# EAGLE design Pi3ToRFIDSchematic (EAGLE 8.7.0)

## Sheet 1 of 2: BoardOne
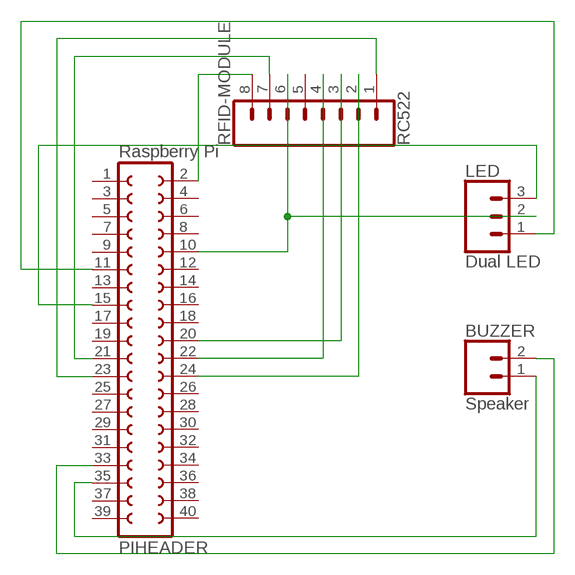
[diagram p0: schematic, sheet 1]

### Parts
BUZZER  Speaker  CONN_02POLAR  [MOLEX-1X2]
LED  Dual LED  CONN_03POLAR  [MOLEX-1X3]
PIHEADER  Raspberry Pi  FE20-2W  [FE20-2W]
RFID-MODULE  RC522  CONN_08LONGPADS  [1X08_LONGPADS]

### Nets
N$1: PIHEADER.2 RFID-MODULE.8
N$2: PIHEADER.21 RFID-MODULE.7
N$3: PIHEADER.22 RFID-MODULE.4
N$4: PIHEADER.20 RFID-MODULE.3
N$5: PIHEADER.24 RFID-MODULE.2
N$6: PIHEADER.23 RFID-MODULE.1
N$7: BUZZER.2 PIHEADER.33
N$8: LED.1 PIHEADER.11
N$10: BUZZER.1 PIHEADER.35
N$11: LED.3 PIHEADER.15
N$12: LED.2 PIHEADER.10 RFID-MODULE.6
Unconnected: PIHEADER.1 PIHEADER.3 PIHEADER.4 PIHEADER.5 PIHEADER.6 PIHEADER.7 PIHEADER.8 PIHEADER.9 PIHEADER.12 PIHEADER.13 PIHEADER.14 PIHEADER.16 PIHEADER.17 PIHEADER.18 PIHEADER.19 PIHEADER.25 PIHEADER.26 PIHEADER.27 PIHEADER.28 PIHEADER.29 PIHEADER.30 PIHEADER.31 PIHEADER.32 PIHEADER.34 PIHEADER.36 PIHEADER.37 PIHEADER.38 PIHEADER.39 PIHEADER.40 RFID-MODULE.5

## Sheet 2 of 2: BoardTwo
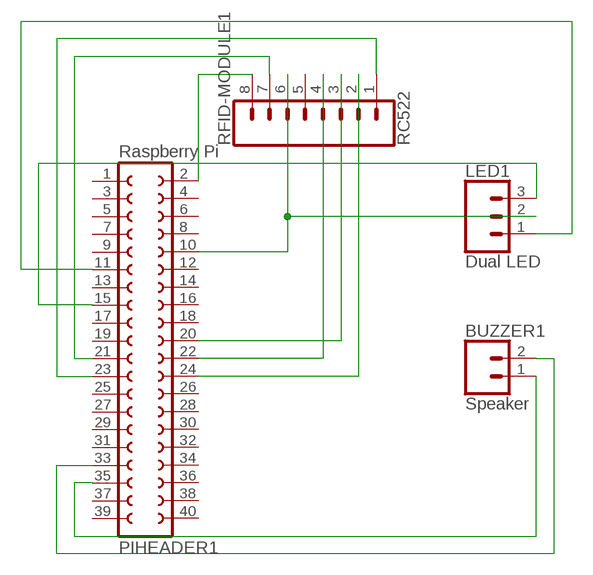
[diagram p1: schematic, sheet 2]

### Parts
BUZZER1  Speaker  CONN_02POLAR  [MOLEX-1X2]
LED1  Dual LED  CONN_03POLAR  [MOLEX-1X3]
PIHEADER1  Raspberry Pi  FE20-2W  [FE20-2W]
RFID-MODULE1  RC522  CONN_08LONGPADS  [1X08_LONGPADS]

### Nets
N$9: PIHEADER1.2 RFID-MODULE1.8
N$13: PIHEADER1.21 RFID-MODULE1.7
N$14: PIHEADER1.22 RFID-MODULE1.4
N$15: PIHEADER1.20 RFID-MODULE1.3
N$16: PIHEADER1.24 RFID-MODULE1.2
N$17: PIHEADER1.23 RFID-MODULE1.1
N$18: BUZZER1.2 PIHEADER1.33
N$19: BUZZER1.1 PIHEADER1.35
N$20: LED1.3 PIHEADER1.15
N$21: LED1.1 PIHEADER1.11
N$22: LED1.2 PIHEADER1.10 RFID-MODULE1.6
Unconnected: PIHEADER1.1 PIHEADER1.3 PIHEADER1.4 PIHEADER1.5 PIHEADER1.6 PIHEADER1.7 PIHEADER1.8 PIHEADER1.9 PIHEADER1.12 PIHEADER1.13 PIHEADER1.14 PIHEADER1.16 PIHEADER1.17 PIHEADER1.18 PIHEADER1.19 PIHEADER1.25 PIHEADER1.26 PIHEADER1.27 PIHEADER1.28 PIHEADER1.29 PIHEADER1.30 PIHEADER1.31 PIHEADER1.32 PIHEADER1.34 PIHEADER1.36 PIHEADER1.37 PIHEADER1.38 PIHEADER1.39 PIHEADER1.40 RFID-MODULE1.5

## Library data of the parts
BUZZER BUZZER1 = SparkFun-Connectors:CONN_02: Multi connection point. Often used as Generic Header-pin footprint for 0.1 inch spaced/style header connections On any of the 0.1 inch spaced packages, you can populate with these: Break Away Headers - Straight <https://www.sparkfun.com/products/116> (PRT-00116) Break Away Male Headers - Right Angle <https://www.sparkfun.com/products/553> (PRT-00553) Female Headers <https://www.sparkfun.com/products/115> (PRT-00115) Break Away Headers - Machine Pin <https://www.sparkfun.com/products/117> (PRT-00117) Break Away Female Headers - Swiss Machine Pin <https://www.sparkfun.com/products/743> (PRT-00743) For SCREWTERMINALS and SPRING TERMINALS visit here: Screw Terimnals on SparkFun.com <https://www.sparkfun.com/search/results?term=Screw+Terminals> (5mm/3.5mm/2.54mm spacing) This device is also useful as a general connection point to wire up your design to another part of your project. Our various solder wires solder well into these plated through hole pads. Hook-Up Wire - Assortment (Stranded, 22 AWG) <https://www.sparkfun.com/products/11375> (PRT-11375) Hook-Up Wire - Assortment (Solid Core, 22 AWG) <https://www.sparkfun.com/products/11367> (PRT-11367) View the entire wire category on our website here <https://www.sparkfun.com/categories/141> Special notes: Molex polarized connector foot print use with: PRT-08233 with associated crimp pins and housings. 2.54_SCREWTERM for use with PRT-10571. 3.5mm Screw Terminal footprints for PRT-08084 5mm Screw Terminal footprints for use with PRT-08432; SF_ID: PRT-09918
LED LED1 = SparkFun-Connectors:CONN_03: Multi connection point. Often used as Generic Header-pin footprint for 0.1 inch spaced/style header connections On any of the 0.1 inch spaced packages, you can populate with these: Break Away Headers - Straight <https://www.sparkfun.com/products/116> (PRT-00116) Break Away Male Headers - Right Angle <https://www.sparkfun.com/products/553> (PRT-00553) Female Headers <https://www.sparkfun.com/products/115> (PRT-00115) Break Away Headers - Machine Pin <https://www.sparkfun.com/products/117> (PRT-00117) Break Away Female Headers - Swiss Machine Pin <https://www.sparkfun.com/products/743> (PRT-00743) Stackable Header - 3 Pin (Female, 0.1") <https://www.sparkfun.com/products/13875> (PRT-13875) For SCREWTERMINALS and SPRING TERMINALS visit here: Screw Terimnals on SparkFun.com <https://www.sparkfun.com/search/results?term=Screw+Terminals> (5mm/3.5mm/2.54mm spacing) This device is also useful as a general connection point to wire up your design to another part of your project. Our various solder wires solder well into these plated through hole pads. Hook-Up Wire - Assortment (Stranded, 22 AWG) <https://www.sparkfun.com/products/11375> (PRT-11375) Hook-Up Wire - Assortment (Solid Core, 22 AWG) <https://www.sparkfun.com/products/11367> (PRT-11367) View the entire wire category on our website here <https://www.sparkfun.com/categories/141> Special notes: Molex polarized connector foot print use with SKU : PRT-08232 with associated crimp pins and housings.; PROD_ID: CONN-08625; SF_ID: PRT-08096
PIHEADER PIHEADER1 = con-lsta:FE20-2W: FEMALE HEADER; OC_FARNELL: unknown; OC_NEWARK: unknown
RFID-MODULE RFID-MODULE1 = SparkFun-Connectors:CONN_08: Multi connection point. Often used as Generic Header-pin footprint for 0.1 inch spaced/style header connections On any of the 0.1 inch spaced packages, you can populate with these: Break Away Headers - Straight <https://www.sparkfun.com/products/116> (PRT-00116) Break Away Male Headers - Right Angle <https://www.sparkfun.com/products/553> (PRT-00553) Female Headers <https://www.sparkfun.com/products/115> (PRT-00115) Break Away Headers - Machine Pin <https://www.sparkfun.com/products/117> (PRT-00117) Break Away Female Headers - Swiss Machine Pin <https://www.sparkfun.com/products/743> (PRT-00743) Arduino Stackable Header - 8 Pin <https://www.sparkfun.com/products/9279> (PRT-09279) For SCREWTERMINALS and SPRING TERMINALS visit here: Screw Terimnals on SparkFun.com <https://www.sparkfun.com/search/results?term=Screw+Terminals> (5mm/3.5mm/2.54mm spacing) This device is also useful as a general connection point to wire up your design to another part of your project. Our various solder wires solder well into these plated through hole pads. Hook-Up Wire - Assortment (Stranded, 22 AWG) <https://www.sparkfun.com/products/11375> (PRT-11375) Hook-Up Wire - Assortment (Solid Core, 22 AWG) <https://www.sparkfun.com/products/11367> (PRT-11367) View the entire wire category on our website here <https://www.sparkfun.com/categories/141> Special notes: Molex polarized connector foot print use with SKU : PRT-08231 with associated crimp pins and housings. 1MM SMD Version SKU: PRT-10208 NOTES ON THE VARIANTS LOCK and LOCK_LONGPADS... This footprint was designed to help hold the alignment of a through-hole component (i.e. 6-pin header) while soldering it into place. You may notice that each hole has been shifted either up or down by 0.005 of an inch from it's more standard position (which is a perfectly straight line). This slight alteration caused the pins (the squares in the middle) to touch the edges of the holes. Because they are alternating, it causes a "brace" to hold the component in place. 0.005 has proven to be the perfect amount of "off-center" position when using our standard breakaway headers. Although looks a little odd when you look at the bare footprint, once you have a header in there, the alteration is very hard to notice. Also,if you push a header all the way into place, it is covered up entirely on the bottom side.

## Net classes
0 default: width 1 mm, drill 0.8 mm, clearance 0.4 mm

## Board
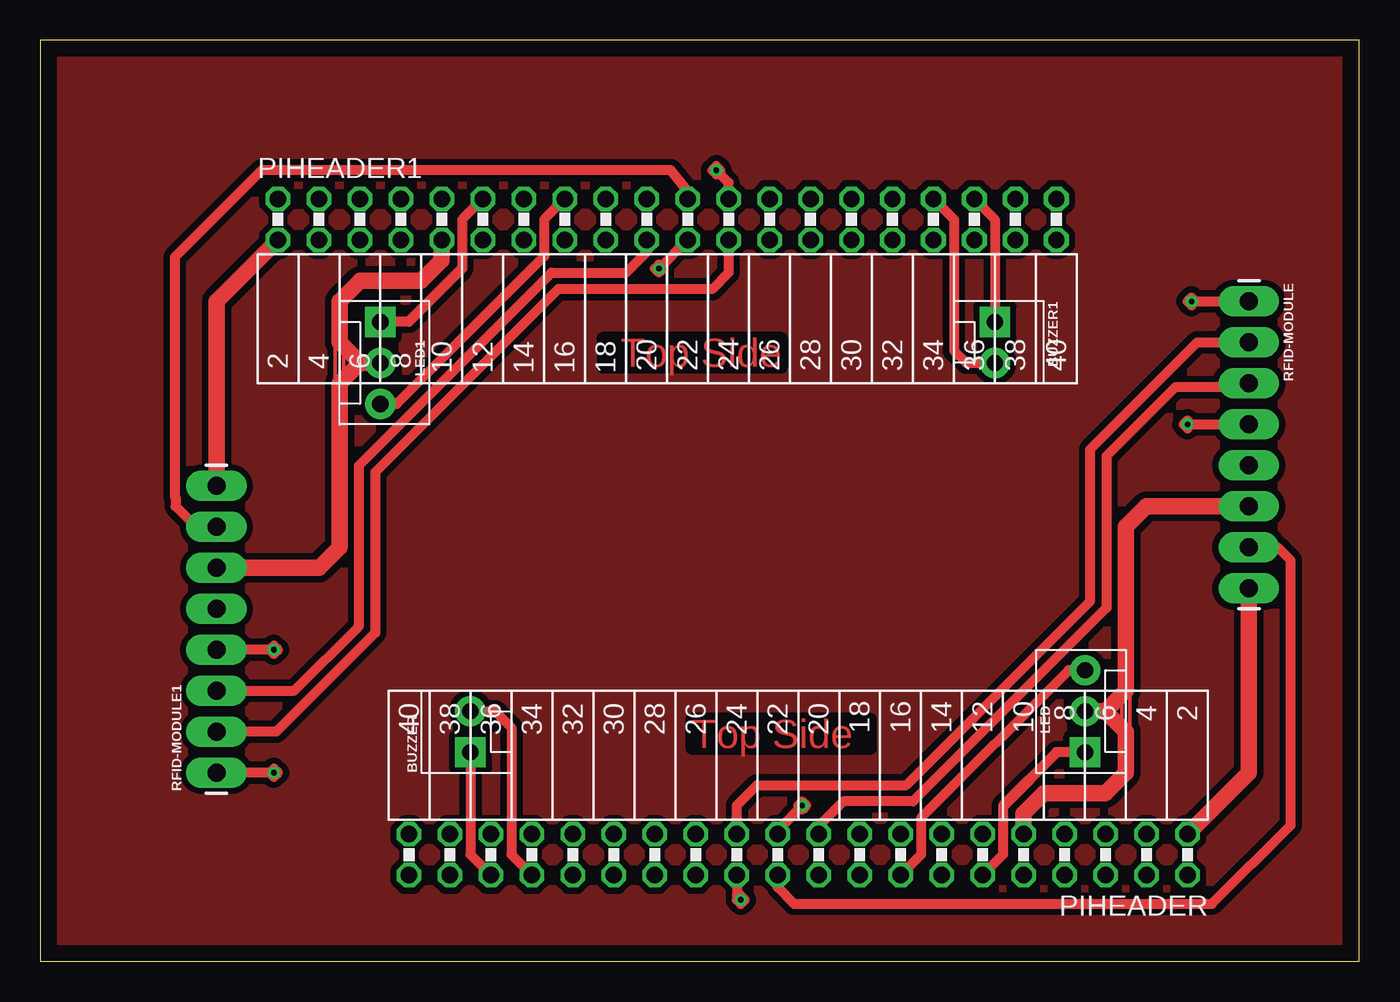
[diagram p2: board, top side]
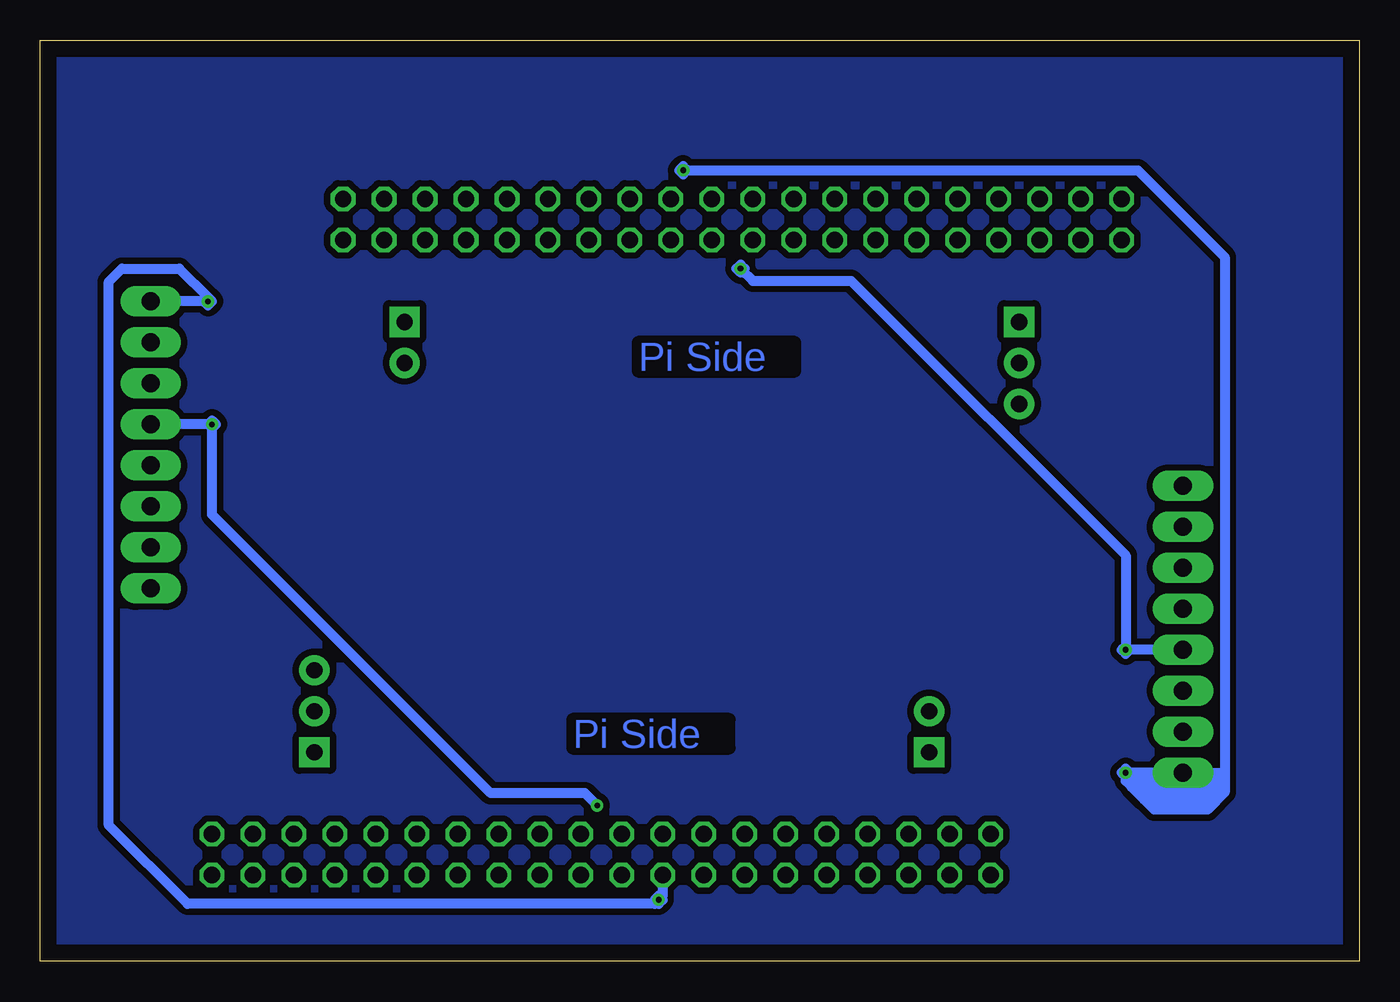
[diagram p3: board, bottom side, seen from below]

Size 81.77 x 57.07 mm. Coordinates in mm from the lower left corner, seen from the top.
Outline: 0,0 81.77,0 81.77,57.07 0,57.07 0,0
Copper layers (1*16): Top 0.035mm / dielectric 1.5mm / Bottom 0.035mm
Design rules "default *": minimum track width 6mil, minimum drill 0.35mm, track to track 6mil, track to pad 2mil, pad to pad 6mil, via to via 6mil, smd to smd 6mil, copper to edge 40mil, drill to drill 6mil, minimum pad ring 10mil, minimum via ring 8mil, stop-mask expansion 4mil, vias tented up to drill 0mil, thermal gap 10mil

### Footprints (pad centres in the part's own frame; a part is rotated, then mirrored left to right if it is on the bottom)
MOLEX-1X2 = drill 1.016 pad 1.88 square: 1 0,0 | drill 1.016 pad 1.88: 2 2.54,0
MOLEX-1X3 = drill 1.016 pad 1.88 square: 1 0,0 | drill 1.016 pad 1.88: 2 2.54,0; 3 5.08,0
FE20-2W = drill 1.016 octagon: 1 -24.13,1.27; 2 -24.13,-1.27; 3 -21.59,1.27; 4 -21.59,-1.27; 5 -19.05,1.27; 6 -19.05,-1.27; 7 -16.51,1.27; 8 -16.51,-1.27; 9 -13.97,1.27; 10 -13.97,-1.27; 11 -11.43,1.27; 12 -11.43,-1.27; 13 -8.89,1.27; 14 -8.89,-1.27; 15 -6.35,1.27; 16 -6.35,-1.27; 17 -3.81,1.27; 18 -3.81,-1.27; 19 -1.27,1.27; 20 -1.27,-1.27; 21 1.27,1.27; 22 1.27,-1.27; 23 3.81,1.27; 24 3.81,-1.27; 25 6.35,1.27; 26 6.35,-1.27; 27 8.89,1.27; 28 8.89,-1.27; 29 11.43,1.27; 30 11.43,-1.27; 31 13.97,1.27; 32 13.97,-1.27; 33 16.51,1.27; 34 16.51,-1.27; 35 19.05,1.27; 36 19.05,-1.27; 37 21.59,1.27; 38 21.59,-1.27; 39 24.13,1.27; 40 24.13,-1.27
1X08_LONGPADS = drill 1.118 pad 1.88 long: 1 0,0; 2 2.54,0; 3 5.08,0; 4 7.62,0; 5 10.16,0; 6 12.7,0; 7 15.24,0; 8 17.78,0

### Placement (x,y rotation side)
BUZZER  26.67,12.95 90 top
BUZZER1  59.18,39.62 270 top
LED  64.77,12.95 90 top
LED1  21.08,39.62 270 top
PIHEADER  46.99,6.6 180 top
PIHEADER1  38.86,45.97 0 top
RFID-MODULE  74.93,40.89 270 top
RFID-MODULE1  10.92,11.68 90 top

### Tracks (layer width: path | path; a pad name or v marks a point on that pad's centre or on a via)
N$1
  Top 1.016: PIHEADER.2 74.93,11.68 RFID-MODULE.8
N$2
  Top 0.61: PIHEADER.21 45.72,4.57 46.74,3.56 72.64,3.56 77.51,8.43 77.51,24.85 76.71,25.65 RFID-MODULE.7
N$3  (via drill 0.35)
  Top 0.61: 71.37,33.27 v71.12,33.27 71.12,33.53 | 71.37,33.27 RFID-MODULE.4 | 71.12,33.53 70.87,33.27 71.12,33.02 71.37,33.27 | 71.37,33.27 71.12,33.53 | 47.24,9.4 v47.24,9.65 45.72,8.13 PIHEADER.22 | 47.24,9.4 47.5,9.65 47.24,9.91 46.99,9.65 47.24,9.4
  Bottom 0.61: v47.24,9.65 48.01,10.41 53.85,10.41 71.12,27.69 71.12,33.02 | 71.12,33.02 v71.12,33.27 71.12,33.53 | 71.12,33.53 70.87,33.27 71.12,33.02 | 71.12,33.02 71.37,33.27 | 71.12,33.53 71.37,33.27 | 71.37,33.27 RFID-MODULE.4 | PIHEADER.22 45.72,8.13
N$4
  Top 0.61: RFID-MODULE.3 74.68,35.56 70.36,35.56 66.1,31.3 66.1,21.9 54.1,9.91 49.78,9.91 48.26,8.38 PIHEADER.20
N$5
  Top 0.61: PIHEADER.24 43.18,9.65 44.44,10.92 53.68,10.92 65.09,22.32 65.09,31.72 71.72,38.35 RFID-MODULE.2
N$6  (via drill 0.35)
  Top 0.61: 71.63,40.89 v71.37,40.89 71.37,41.15 | 71.63,40.89 RFID-MODULE.1 | PIHEADER.23 43.18,4.06 v43.43,3.81 43.43,4.06 | 71.37,41.15 71.12,40.89 71.37,40.64 71.63,40.89 | 71.63,40.89 71.37,41.15 | 43.43,4.06 43.69,3.81 43.43,3.56 43.18,3.81 43.43,4.06
  Bottom 0.61: v43.43,3.81 43.69,3.56 72.64,3.56 77.51,8.43 77.51,42.12 76.71,42.93 73.15,42.93 71.37,41.15 | 71.37,41.15 v71.37,40.89 71.63,40.89 | 71.63,40.89 71.37,41.15 | 71.37,41.15 71.12,40.89 71.37,40.64 71.63,40.89 | 71.63,40.89 RFID-MODULE.1 | PIHEADER.23 43.18,4.06 v43.43,3.81 | v43.43,3.81 43.69,3.81 | 43.69,3.81 43.43,4.06 43.18,3.81 43.43,3.56 43.69,3.81
N$7
  Top 0.61: BUZZER.2 28.19,15.49 29.21,14.48 29.21,6.6 PIHEADER.33
N$8
  Top 0.203: 59.69,6.6 59.7,6.61 59.7,9.31 63.34,12.95 LED.1
  Top 0.61: LED.1 62.99,12.95 59.69,9.65 59.69,6.6 PIHEADER.11
N$9
  Top 1.016: PIHEADER1.2 10.92,40.89 RFID-MODULE1.8
N$10
  Top 0.61: BUZZER.1 26.67,6.6 PIHEADER.35
N$11
  Top 0.203: 63.75,18.03 63.5,18.03 54.61,9.14 54.61,8.38
  Top 0.61: LED.3 63.75,18.03 54.61,8.89 54.61,8.38 54.61,6.6 PIHEADER.15
N$12
  Top 1.016: PIHEADER.10 60.96,9.14 62.23,10.41 66.04,10.41 67.31,11.68 67.31,14.22 | 67.31,14.22 66.04,15.49 | 66.04,15.49 LED.2 | RFID-MODULE.6 68.58,28.19 67.31,26.92 67.31,16.76 66.04,15.49 | 67.31,14.22 | 67.31,14.22
N$13
  Top 0.61: PIHEADER1.21 40.13,47.75 39.12,49.02 13.72,49.02 8.34,43.64 8.34,28.78 8.38,28.74 8.38,28.19 9.65,26.92 RFID-MODULE1.7
N$14  (via drill 0.35)
  Top 0.61: PIHEADER1.22 v38.35,42.93 38.1,42.93 | 14.22,19.3 v14.48,19.3 14.73,19.3 | 14.22,19.3 RFID-MODULE1.4 | 14.73,19.3 14.48,19.05 14.22,19.3 | 14.22,19.3 14.48,19.56 14.73,19.3 | 38.1,42.93 38.35,43.18 38.61,42.93 38.35,42.67 38.1,42.93
  Bottom 0.61: 14.48,19.56 14.48,25.15 31.5,42.16 37.59,42.16 v38.35,42.93 38.61,42.93 | RFID-MODULE1.4 14.22,19.3 | 14.22,19.3 v14.48,19.3 14.48,19.56 | 14.48,19.56 14.73,19.3 14.48,19.05 14.22,19.3 | 14.22,19.3 14.48,19.56 | 38.61,42.93 38.35,43.18 38.1,42.93 38.35,42.67 38.61,42.93
N$15
  Top 0.61: RFID-MODULE1.3 15.75,16.76 19.75,20.77 19.75,30.73 31.69,42.67 36.32,42.67 37.59,43.94 PIHEADER1.20
N$16
  Top 0.61: PIHEADER1.24 42.67,42.67 41.66,41.66 32.11,41.66 20.76,30.32 20.76,20.35 14.64,14.22 RFID-MODULE1.2
N$17  (via drill 0.35)
  Top 0.152: 10.67,11.43 RFID-MODULE1.1
  Top 0.61: PIHEADER1.23 42.67,48.26 v41.91,49.02 42.16,49.02 | 14.22,11.68 v14.48,11.68 14.48,11.94 | 14.22,11.68 RFID-MODULE1.1 | 14.48,11.94 14.73,11.68 14.48,11.43 14.22,11.68 | 14.22,11.68 14.48,11.94 | 42.16,49.02 41.91,49.28 41.66,49.02 41.91,48.77 42.16,49.02
  Bottom 0.61: 41.66,49.02 13.72,49.02 8.34,43.64 8.34,10.46 9.4,9.4 12.7,9.4 14.48,11.18 14.48,11.43 | 14.48,11.43 v14.48,11.68 | 14.22,11.68 RFID-MODULE1.1 8.38,11.68 | 14.22,11.68 v14.48,11.68 | v14.48,11.68 14.48,11.94 | 14.48,11.94 14.73,11.68 14.48,11.43 | 14.48,11.43 14.22,11.68 | 14.22,11.68 14.48,11.94 | v41.91,49.02 41.66,49.02 | 41.66,49.02 41.91,49.28 42.16,49.02 41.91,48.77 41.66,49.02
N$18
  Top 0.61: PIHEADER1.33 56.64,45.97 56.64,37.85 57.4,37.08 BUZZER1.2
N$19
  Top 0.61: PIHEADER1.35 59.18,45.97 BUZZER1.1
N$20
  Top 0.203: 31.24,45.97 31.24,43.43 22.35,34.54 LED1.3
  Top 0.61: PIHEADER1.15 31.24,45.97 31.24,43.69 22.1,34.54 LED1.3
N$21
  Top 0.203: 26.16,45.97 26.16,43.27 22.51,39.62 LED1.1
  Top 0.61: PIHEADER1.11 26.16,45.97 26.16,42.93 22.86,39.62 LED1.1
N$22
  Top 1.016: PIHEADER1.10 24.89,43.43 23.62,42.16 19.81,42.16 18.54,40.89 18.54,38.35 19.81,37.08 | 19.81,37.08 LED1.2 | 19.81,37.08 18.54,35.81 18.54,25.65 17.27,24.38 RFID-MODULE1.6
N$23
  pour Bottom: -0.25,57.15 82.04,57.15 82.3,56.9 82.3,0.51 82.04,0.25 0,0.25 -0.25,0
N$24
  pour Top: -0.25,56.9 82.04,56.9 82.04,0 0.25,0 -0.25,56.64
N$25
  Bottom 1.016: 8.64,10.92 13.97,10.92 13.21,10.16 9.14,10.16
S$1
  Top 0.203: 67.56,16.76 67.56,14.22
S$2
  Top 0.203: 67.06,16 67.06,14.73
S$3
  Top 0.203: 18.29,38.35 18.29,36.07
S$4
  Top 0.203: 18.8,37.59 18.8,36.32

### Text on the board
Top: Top Side | Top Side
Bottom: Pi Side | Pi Side